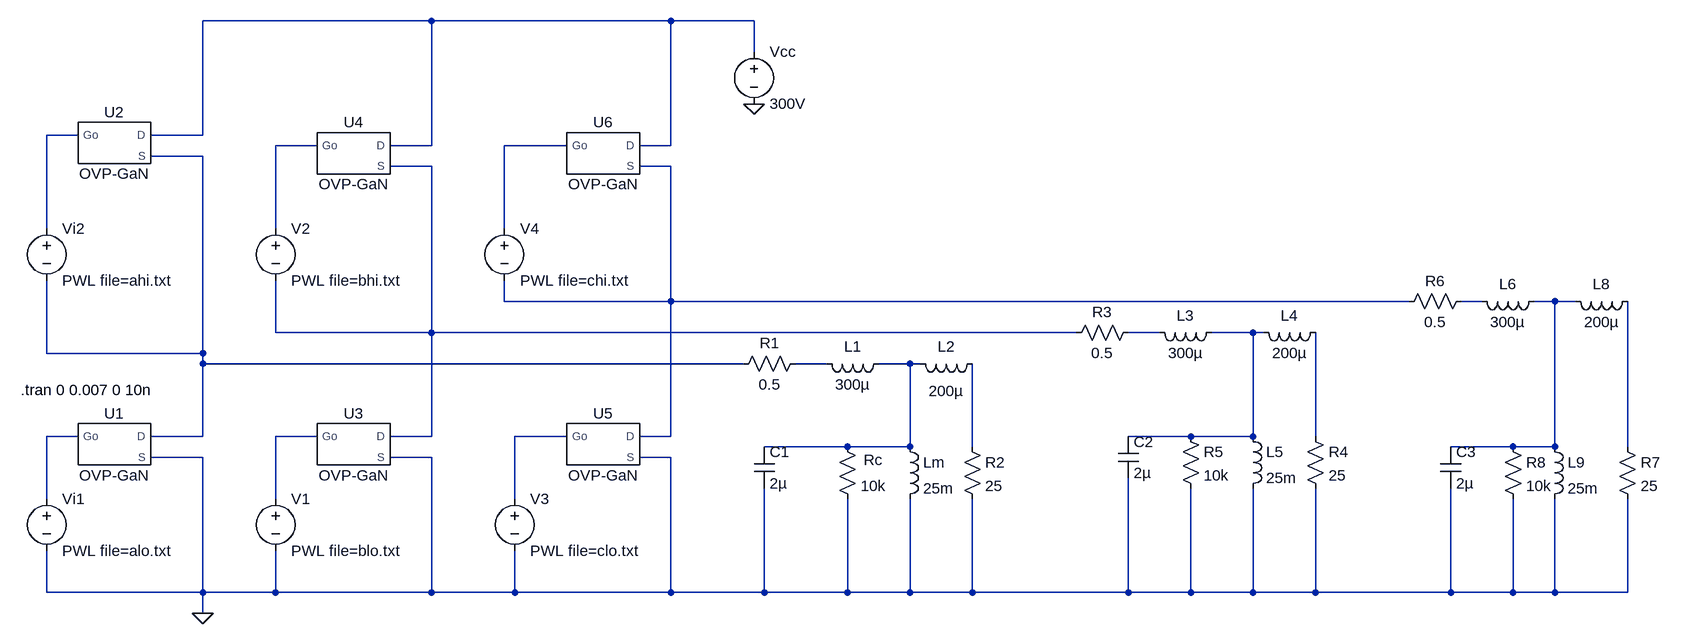
[diagram p0: schematic motor.asc]
motor.asc, the LTspice schematic file:
Version 4
SHEET 1 2120 680
WIRE 224 -496 -128 -496
WIRE 592 -496 224 -496
WIRE 720 -496 592 -496
WIRE 720 -448 720 -496
WIRE -320 -320 -368 -320
WIRE -128 -320 -128 -496
WIRE -128 -320 -208 -320
WIRE 48 -304 -16 -304
WIRE 224 -304 224 -496
WIRE 224 -304 160 -304
WIRE 432 -304 336 -304
WIRE 592 -304 592 -496
WIRE 592 -304 544 -304
WIRE -128 -288 -208 -288
WIRE 224 -272 160 -272
WIRE 592 -272 544 -272
WIRE -368 -176 -368 -320
WIRE -16 -176 -16 -304
WIRE 336 -176 336 -304
WIRE 336 -64 336 -96
WIRE 592 -64 592 -272
WIRE 592 -64 336 -64
WIRE 1728 -64 592 -64
WIRE 1840 -64 1808 -64
WIRE 1952 -64 1920 -64
WIRE 1984 -64 1952 -64
WIRE -16 -16 -16 -96
WIRE 224 -16 224 -272
WIRE 224 -16 -16 -16
WIRE 1216 -16 224 -16
WIRE 1344 -16 1296 -16
WIRE 1488 -16 1424 -16
WIRE 1504 -16 1488 -16
WIRE -368 16 -368 -96
WIRE -128 16 -128 -288
WIRE -128 16 -368 16
WIRE -128 32 -128 16
WIRE 704 32 -128 32
WIRE 832 32 784 32
WIRE 960 32 912 32
WIRE 976 32 960 32
WIRE -320 144 -368 144
WIRE -128 144 -128 32
WIRE -128 144 -208 144
WIRE 48 144 -16 144
WIRE 224 144 224 -16
WIRE 224 144 160 144
WIRE 432 144 352 144
WIRE 592 144 592 -64
WIRE 592 144 544 144
WIRE 1392 144 1296 144
WIRE 1488 144 1488 -16
WIRE 1488 144 1392 144
WIRE 1584 144 1584 -16
WIRE 864 160 736 160
WIRE 960 160 960 32
WIRE 960 160 864 160
WIRE 1056 160 1056 32
WIRE 1888 160 1792 160
WIRE 1952 160 1952 -64
WIRE 1952 160 1888 160
WIRE 2064 160 2064 -64
WIRE -128 176 -208 176
WIRE 224 176 160 176
WIRE 592 176 544 176
WIRE -368 240 -368 144
WIRE -16 240 -16 144
WIRE 352 240 352 144
WIRE -368 384 -368 320
WIRE -128 384 -128 176
WIRE -128 384 -368 384
WIRE -16 384 -16 320
WIRE -16 384 -128 384
WIRE 224 384 224 176
WIRE 224 384 -16 384
WIRE 352 384 352 320
WIRE 352 384 224 384
WIRE 592 384 592 176
WIRE 592 384 352 384
WIRE 736 384 736 224
WIRE 736 384 592 384
WIRE 864 384 864 240
WIRE 864 384 736 384
WIRE 960 384 960 240
WIRE 960 384 864 384
WIRE 1056 384 1056 240
WIRE 1056 384 960 384
WIRE 1296 384 1296 208
WIRE 1296 384 1056 384
WIRE 1392 384 1392 224
WIRE 1392 384 1296 384
WIRE 1488 384 1488 224
WIRE 1488 384 1392 384
WIRE 1584 384 1584 224
WIRE 1584 384 1488 384
WIRE 1792 384 1792 224
WIRE 1792 384 1584 384
WIRE 1888 384 1888 240
WIRE 1888 384 1792 384
WIRE 1952 384 1952 240
WIRE 1952 384 1888 384
WIRE 2064 384 2064 240
WIRE 2064 384 1952 384
WIRE -128 416 -128 384
FLAG -128 416 0
FLAG 720 -368 0
SYMBOL voltage -368 224 R0
WINDOW 123 0 0 Left 2
WINDOW 39 0 0 Left 2
SYMATTR InstName Vi1
SYMATTR Value PWL file=alo.txt
SYMBOL voltage -368 -192 R0
WINDOW 123 0 0 Left 2
WINDOW 39 0 0 Left 2
SYMATTR InstName Vi2
SYMATTR Value PWL file=ahi.txt
SYMBOL voltage 720 -464 R0
WINDOW 123 0 0 Left 2
WINDOW 39 9 129 Left 2
SYMATTR InstName Vcc
SYMATTR Value 300V
SYMBOL res 800 16 R90
WINDOW 0 0 56 VBottom 2
WINDOW 3 32 56 VTop 2
SYMATTR InstName R1
SYMATTR Value 0.5
SYMBOL ind 928 16 R90
WINDOW 0 5 56 VBottom 2
WINDOW 3 32 56 VTop 2
SYMATTR InstName L1
SYMATTR Value 300µ
SYMBOL ind 1072 16 R90
WINDOW 0 5 56 VBottom 2
WINDOW 3 42 56 VTop 2
SYMATTR InstName L2
SYMATTR Value 200µ
SYMBOL res 1040 144 R0
SYMATTR InstName R2
SYMATTR Value 25
SYMBOL res 848 144 R0
WINDOW 0 41 36 Left 2
SYMATTR InstName Rc
SYMATTR Value 10k
SYMBOL ind 944 144 R0
SYMATTR InstName Lm
SYMATTR Value 25m
SYMBOL cap 720 160 R0
SYMATTR InstName C1
SYMATTR Value 2µ
SYMBOL voltage -16 224 R0
WINDOW 123 0 0 Left 0
WINDOW 39 0 0 Left 0
SYMATTR InstName V1
SYMATTR Value PWL file=blo.txt
SYMBOL voltage -16 -192 R0
WINDOW 123 0 0 Left 0
WINDOW 39 0 0 Left 0
SYMATTR InstName V2
SYMATTR Value PWL file=bhi.txt
SYMBOL voltage 352 224 R0
WINDOW 123 0 0 Left 0
WINDOW 39 0 0 Left 0
SYMATTR InstName V3
SYMATTR Value PWL file=clo.txt
SYMBOL voltage 336 -192 R0
WINDOW 123 0 0 Left 0
WINDOW 39 0 0 Left 0
SYMATTR InstName V4
SYMATTR Value PWL file=chi.txt
SYMBOL res 1312 -32 R90
WINDOW 0 0 56 VBottom 2
WINDOW 3 32 56 VTop 2
SYMATTR InstName R3
SYMATTR Value 0.5
SYMBOL ind 1440 -32 R90
WINDOW 0 5 56 VBottom 2
WINDOW 3 32 56 VTop 2
SYMATTR InstName L3
SYMATTR Value 300µ
SYMBOL ind 1600 -32 R90
WINDOW 0 5 56 VBottom 2
WINDOW 3 32 56 VTop 2
SYMATTR InstName L4
SYMATTR Value 200µ
SYMBOL res 1568 128 R0
SYMATTR InstName R4
SYMATTR Value 25
SYMBOL res 1376 128 R0
SYMATTR InstName R5
SYMATTR Value 10k
SYMBOL ind 1472 128 R0
SYMATTR InstName L5
SYMATTR Value 25m
SYMBOL cap 1280 144 R0
SYMATTR InstName C2
SYMATTR Value 2µ
SYMBOL res 1824 -80 R90
WINDOW 0 0 56 VBottom 2
WINDOW 3 32 56 VTop 2
SYMATTR InstName R6
SYMATTR Value 0.5
SYMBOL ind 1936 -80 R90
WINDOW 0 5 56 VBottom 2
WINDOW 3 32 56 VTop 2
SYMATTR InstName L6
SYMATTR Value 300µ
SYMBOL ind 2080 -80 R90
WINDOW 0 5 56 VBottom 2
WINDOW 3 32 56 VTop 2
SYMATTR InstName L8
SYMATTR Value 200µ
SYMBOL res 2048 144 R0
SYMATTR InstName R7
SYMATTR Value 25
SYMBOL res 1872 144 R0
SYMATTR InstName R8
SYMATTR Value 10k
SYMBOL ind 1936 144 R0
SYMATTR InstName L9
SYMATTR Value 25m
SYMBOL cap 1776 160 R0
SYMATTR InstName C3
SYMATTR Value 2µ
SYMBOL OVP-GaN -256 176 R0
SYMATTR InstName U1
SYMBOL OVP-GaN -256 -288 R0
SYMATTR InstName U2
SYMBOL OVP-GaN 112 176 R0
SYMATTR InstName U3
SYMBOL OVP-GaN 112 -272 R0
SYMATTR InstName U4
SYMBOL OVP-GaN 496 176 R0
SYMATTR InstName U5
SYMBOL OVP-GaN 496 -272 R0
SYMATTR InstName U6
TEXT -408 72 Left 2 !.tran 0 0.007 0 10n

The netlist it stands for:
* motor.asc
Vi1 N014 0 PWL file=alo.txt
Vi2 N002 N005 PWL file=ahi.txt
Vcc N001 0 300V
R1 N012 N005 0.5
L1 N013 N012 300µ
L2 N018 N013 200µ
R2 N018 0 25
Rc N013 0 10k
Lm N013 0 25m
C1 N013 0 2µ
V1 N015 0 PWL file=blo.txt
V2 N003 N006 PWL file=bhi.txt
V3 N016 0 PWL file=clo.txt
V4 N004 N007 PWL file=chi.txt
R3 N010 N006 0.5
L3 N011 N010 300µ
L4 N017 N011 200µ
R4 N017 0 25
R5 N011 0 10k
L5 N011 0 25m
C2 N011 0 2µ
R6 N008 N007 0.5
L6 N009 N008 300µ
L8 N019 N009 200µ
R7 N019 0 25
R8 N009 0 10k
L9 N009 0 25m
C3 N009 0 2µ
XU1 N014 N005 0 OVP-GaN  ; pins Go D S
XU2 N002 N001 N005 OVP-GaN  ; pins Go D S
XU3 N015 N006 0 OVP-GaN  ; pins Go D S
XU4 N003 N001 N006 OVP-GaN  ; pins Go D S
XU5 N016 N007 0 OVP-GaN  ; pins Go D S
XU6 N004 N001 N007 OVP-GaN  ; pins Go D S
.tran 0 0.007 0 10n
.lib OVP-GaN.LIB
.backanno
.end